# EAGLE design etch_a_sketch_schematic (EAGLE 9.6.2)
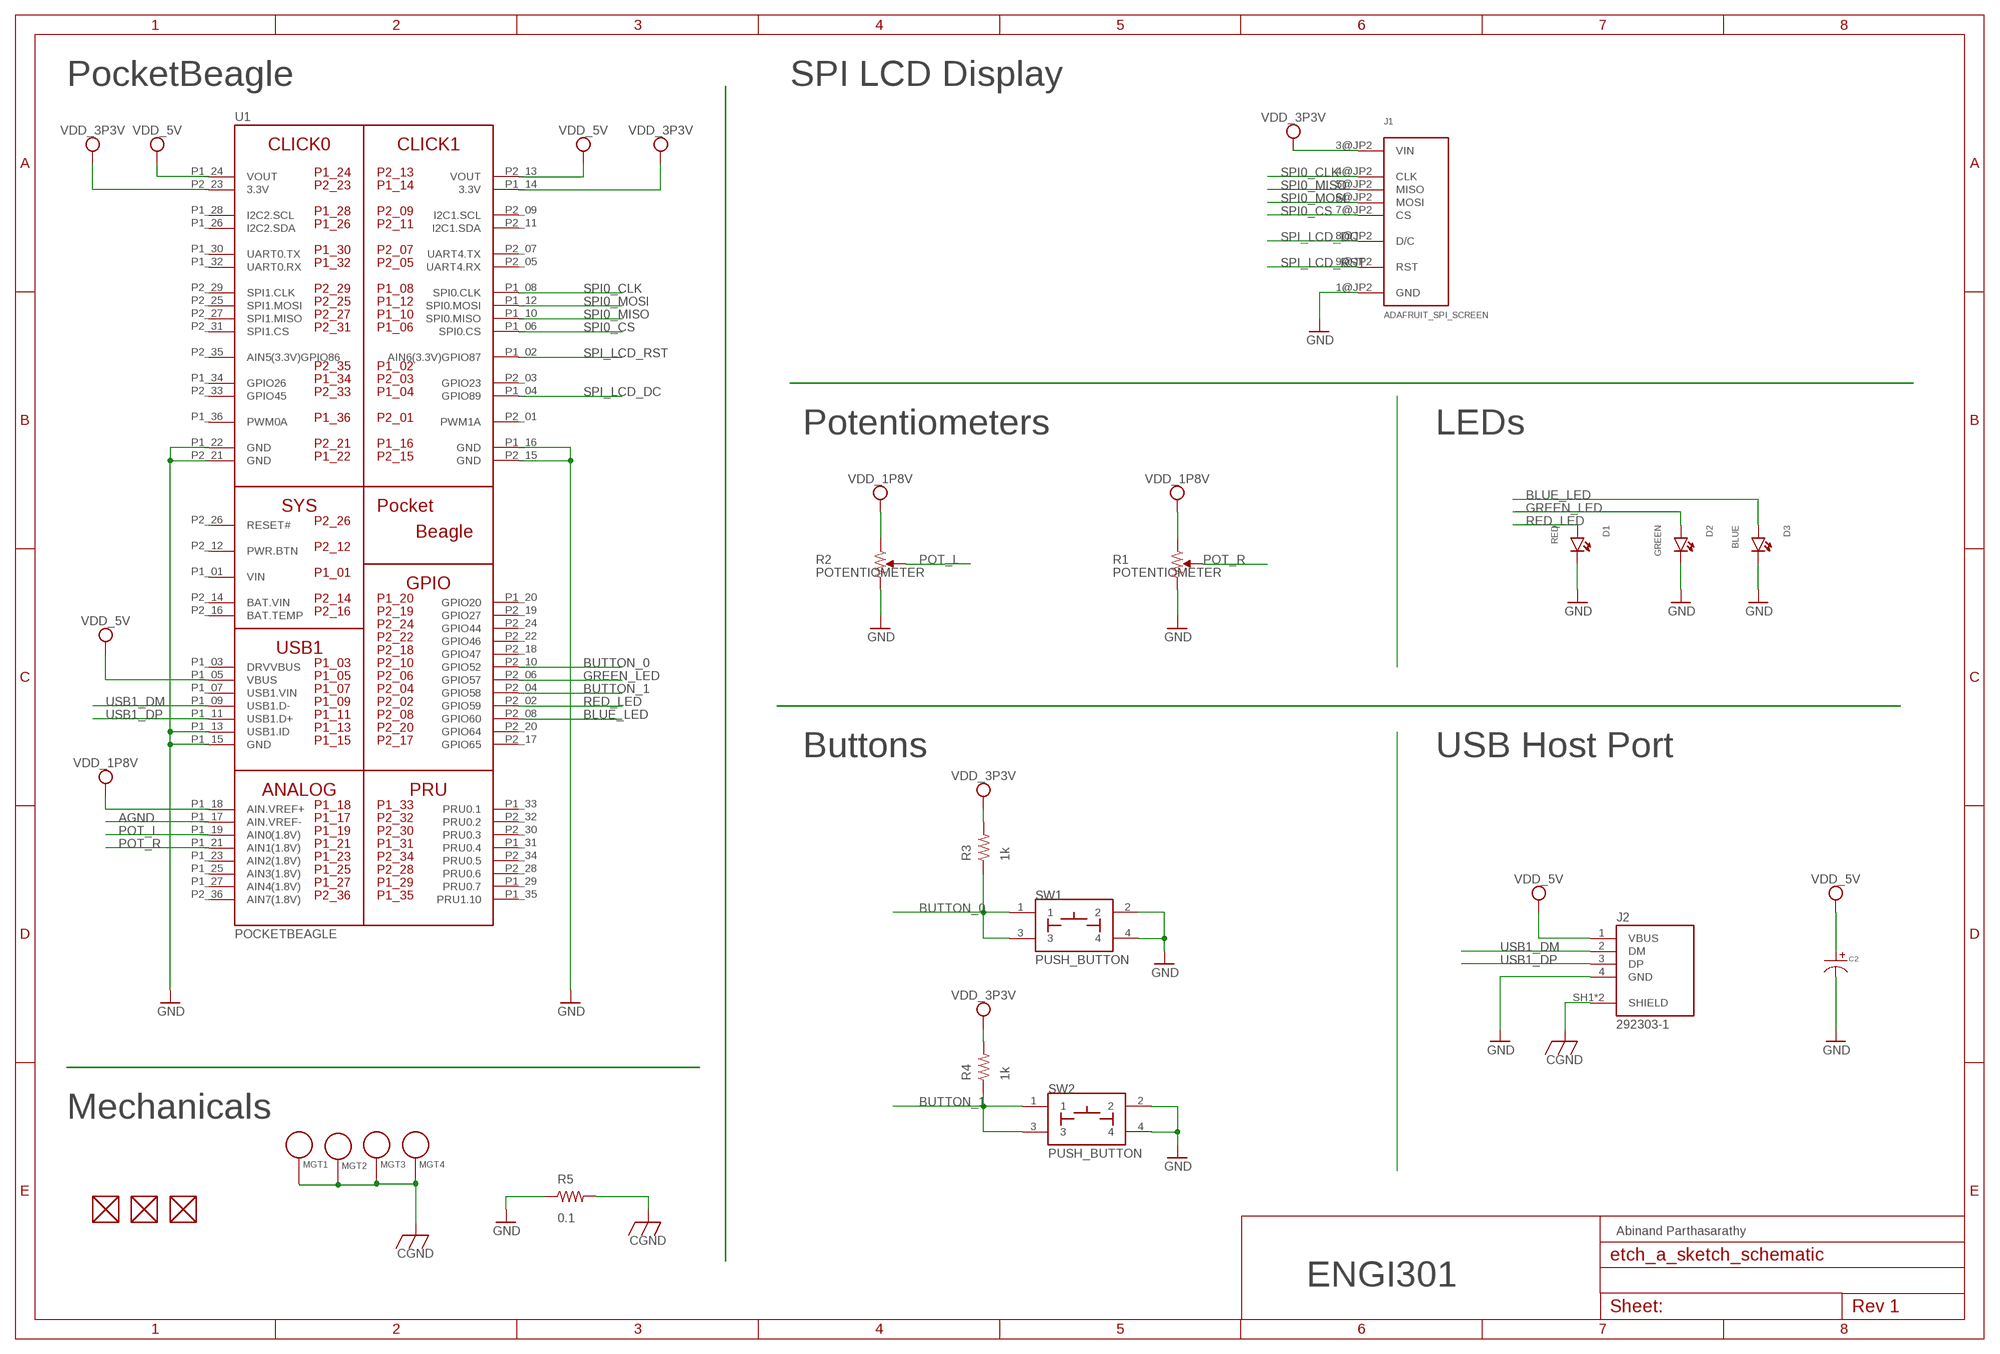
[diagram p0: schematic, sheet 1]

## Parts
C2  CAPACITOR_P_10MM  [CP10MM]
D1  RED  LED  [EIA-STD]
D2  GREEN  LED  [EIA-STD]
D3  BLUE  LED  [EIA-STD]
FUD2  FIDUCIAL  [FIDUCIAL_40MIL]
FUD4  FIDUCIAL  [FIDUCIAL_40MIL]
FUD6  FIDUCIAL  [FIDUCIAL_40MIL]
J1  ADAFRUIT_SPI_SCREEN  [ADAFRUIT_TFT_LCD_PCB]
J2  292303-1  [TE_292303-1]
MGT1  MOUNTING_HOLE  [MOUNTING_HOLE]
MGT2  MOUNTING_HOLE  [MOUNTING_HOLE]
MGT3  MOUNTING_HOLE  [MOUNTING_HOLE]
MGT4  MOUNTING_HOLE  [MOUNTING_HOLE]
R1  POTENTIOMETER  [POT-PO90S]
R2  POTENTIOMETER  [POT-PO90S]
R3  1k  R_R0603  [R0603]
R4  1k  R_R0603  [R0603]
R5  0.1  R_R0603  [R0603]
SW1  PUSH_BUTTON  [BUTTON_12.5MM]
SW2  PUSH_BUTTON  [BUTTON_12.5MM]
U1  POCKETBEAGLE  [POCKETBEAGLE]

## Nets
AGND: U1.P1_17(AIN.VREF-)
BLUE_LED: D3.ANODE U1.P2_08(GPIO60)
BUTTON_0: R3.1 SW1.1 SW1.3 U1.P2_10(GPIO52)
BUTTON_1: R4.1 SW2.1 SW2.3 U1.P2_04(GPIO58)
CGND: J2.SH1(SHIELD) J2.SH2(SHIELD) MGT1.P$1 MGT2.P$1 MGT3.P$1 MGT4.P$1 R5.2
GND: C2.P$2 D1.CATHODE D2.CATHODE D3.CATHODE J1.1@JP2(GND) J2.4(GND) R1.CW R2.CW R5.1 SW1.2 SW1.4 SW2.2 SW2.4 U1.P1_13(USB1.ID) U1.P1_15(GND) U1.P1_16(GND) U1.P1_22(GND) U1.P2_15(GND) U1.P2_21(GND)
GREEN_LED: D2.ANODE U1.P2_06(GPIO57)
POT_L: R2.S U1.P1_19(AIN0(1.8V))
POT_R: R1.S U1.P1_21(AIN1(1.8V))
RED_LED: D1.ANODE U1.P2_02(GPIO59)
SPI0_CLK: J1.4@JP2(CLK) U1.P1_08(SPI0.CLK)
SPI0_CS: J1.7@JP2(CS) U1.P1_06(SPI0.CS)
SPI0_MISO: J1.5@JP2(MISO) U1.P1_10(SPI0.MISO)
SPI0_MOSI: J1.6@JP2(MOSI) U1.P1_12(SPI0.MOSI)
SPI_LCD_DC: J1.8@JP2(D/C) U1.P1_04(GPIO89)
SPI_LCD_RST: J1.9@JP2(RST) U1.P1_02(AIN6(3.3V)GPIO87)
USB1_DM: J2.2(DM) U1.P1_09(USB1.D-)
USB1_DP: J2.3(DP) U1.P1_11(USB1.D+)
VDD_1P8V: R1.CCW R2.CCW U1.P1_18(AIN.VREF+)
VDD_3P3V: J1.3@JP2(VIN) R3.2 R4.2 U1.P1_14(3.3V) U1.P2_23(3.3V)
VDD_5V: C2.P$1 J2.1(VBUS) U1.P1_05(VBUS) U1.P1_24(VOUT) U1.P2_13(VOUT)
Unconnected: FUD2.P$1 FUD4.P$1 FUD6.P$1 U1.P1_03(DRVVBUS) U1.P1_07(USB1.VIN) U1.P1_20(GPIO20) U1.P1_23(AIN2(1.8V)) U1.P1_25(AIN3(1.8V)) U1.P1_26(I2C2.SDA) U1.P1_27(AIN4(1.8V)) U1.P1_28(I2C2.SCL) U1.P1_29(PRU0.7) U1.P1_30(UART0.TX) U1.P1_31(PRU0.4) U1.P1_32(UART0.RX) U1.P1_33(PRU0.1) U1.P1_34(GPIO26) U1.P1_35(PRU1.10) U1.P1_36(PWM0A) U1.P2_01(PWM1A) U1.P2_03(GPIO23) U1.P2_05(UART4.RX) U1.P2_07(UART4.TX) U1.P2_09(I2C1.SCL) U1.P2_11(I2C1.SDA) U1.P2_12(PWR.BTN) U1.P2_16(BAT.TEMP) U1.P2_17(GPIO65) U1.P2_18(GPIO47) U1.P2_19(GPIO27) U1.P2_20(GPIO64) U1.P2_22(GPIO46) U1.P2_24(GPIO44) U1.P2_25(SPI1.MOSI) U1.P2_26(RESET#) U1.P2_27(SPI1.MISO) U1.P2_28(PRU0.6) U1.P2_29(SPI1.CLK) U1.P2_30(PRU0.3) U1.P2_31(SPI1.CS) U1.P2_32(PRU0.2) U1.P2_33(GPIO45) U1.P2_34(PRU0.5) U1.P2_35(AIN5(3.3V)GPIO86) U1.P2_36(AIN7(1.8V))

## Notes on the sheet
- PocketBeagle | SPI LCD Display
- Potentiometers | LEDs
- Buttons | USB Host Port
- Mechanicals
- Abinand Parthasarathy
- ENGI301

## Power pins joined to a net without a drawn wire
BAT.VIN: U1.P2_14(BAT.VIN)
VIN: U1.P1_01(VIN)

## Library data of the parts
C2 = combo_lock2:CAPACITOR_P: Library: MF_Passives Description: Device for Polarized Capacitors. Manufacture part number (MPN), Voltage Rating, and Tolerance can be added via Attributes. Check https://factory.macrofab.com/parts for the house parts list.; POPULATE: 1
D1-D3 = combo_lock2:LED: EIA-STD LED, LTST-C191TBKT
FUD2 FUD4 FUD6 = combo_lock2:FIDUCIAL
J1 = combo_lock2:ADAFRUIT_SPI_SCREEN: Adafruit 2.8'' TFT SPI LCD Display: https://www.adafruit.com/product/1770 Created from: https://github.com/adafruit/2.8-TFT-Breakout-PCB
J2 = combo_lock2:292303-1: CONN USB RECEPT R/A TYPE A 4POS Check availability <https://pricing.snapeda.com/parts/292303-1/TE%20Connectivity/view-part?ref=eda>; AVAILABILITY: In Stock; CENTERLINE_PITCH: 2 mm[.078 in]; COMMENT: 292303-1; DESCRIPTION: Conn; Data; USB; Recept; 2.0; 4 Pos; 1 Port; Rt Angle; A Ser; Tin over Copper; EU_ROHS_COMPLIANCE: Compliant; MF: TE Connectivity; MP: 292303-1; NUMBER_OF_POSITIONS: 4; PACKAGE: None; PRICE: None; PRODUCT_TYPE: Connector; PURCHASE-URL: https://pricing.snapeda.com/search/part/292303-1/?ref=eda
MGT1-MGT4 = combo_lock2:MOUNTING_HOLE: Chassis Mounting Hole w/GND connection ability
R1 R2 = combo_lock2:POTENTIOMETER: Potentiometer - Examples: P090S-14T20BR10K (987-1277-ND)
R3-R5 = combo_lock2:R_: RESISTOR, American symbol
SW1 SW2 = combo_lock2:PUSH_BUTTON
U1 = combo_lock:POCKETBEAGLE

## Board
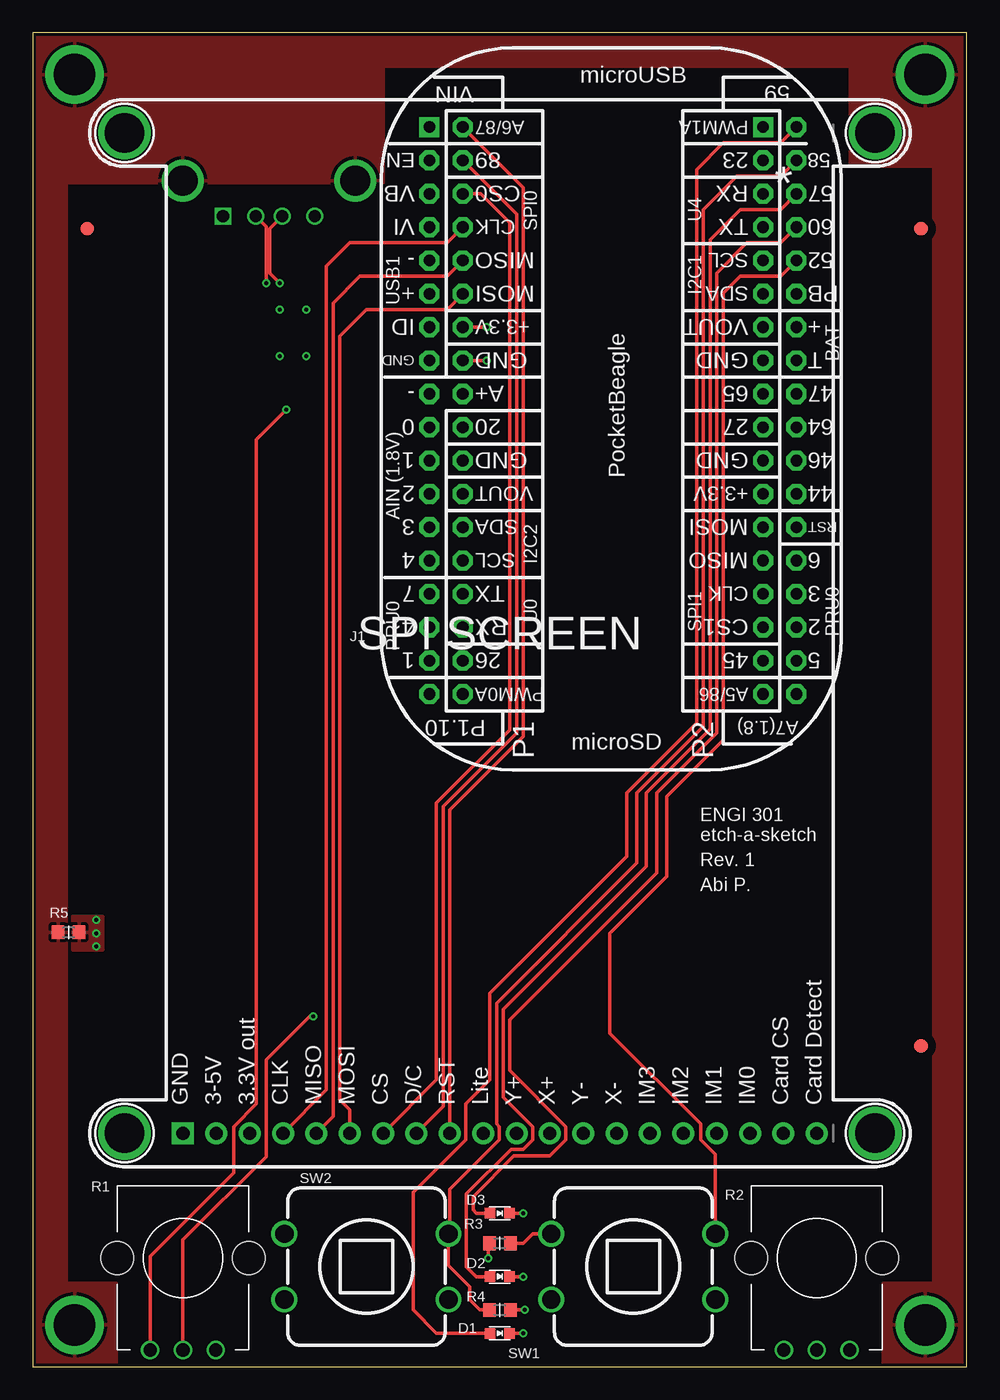
[diagram p1: board, top side]
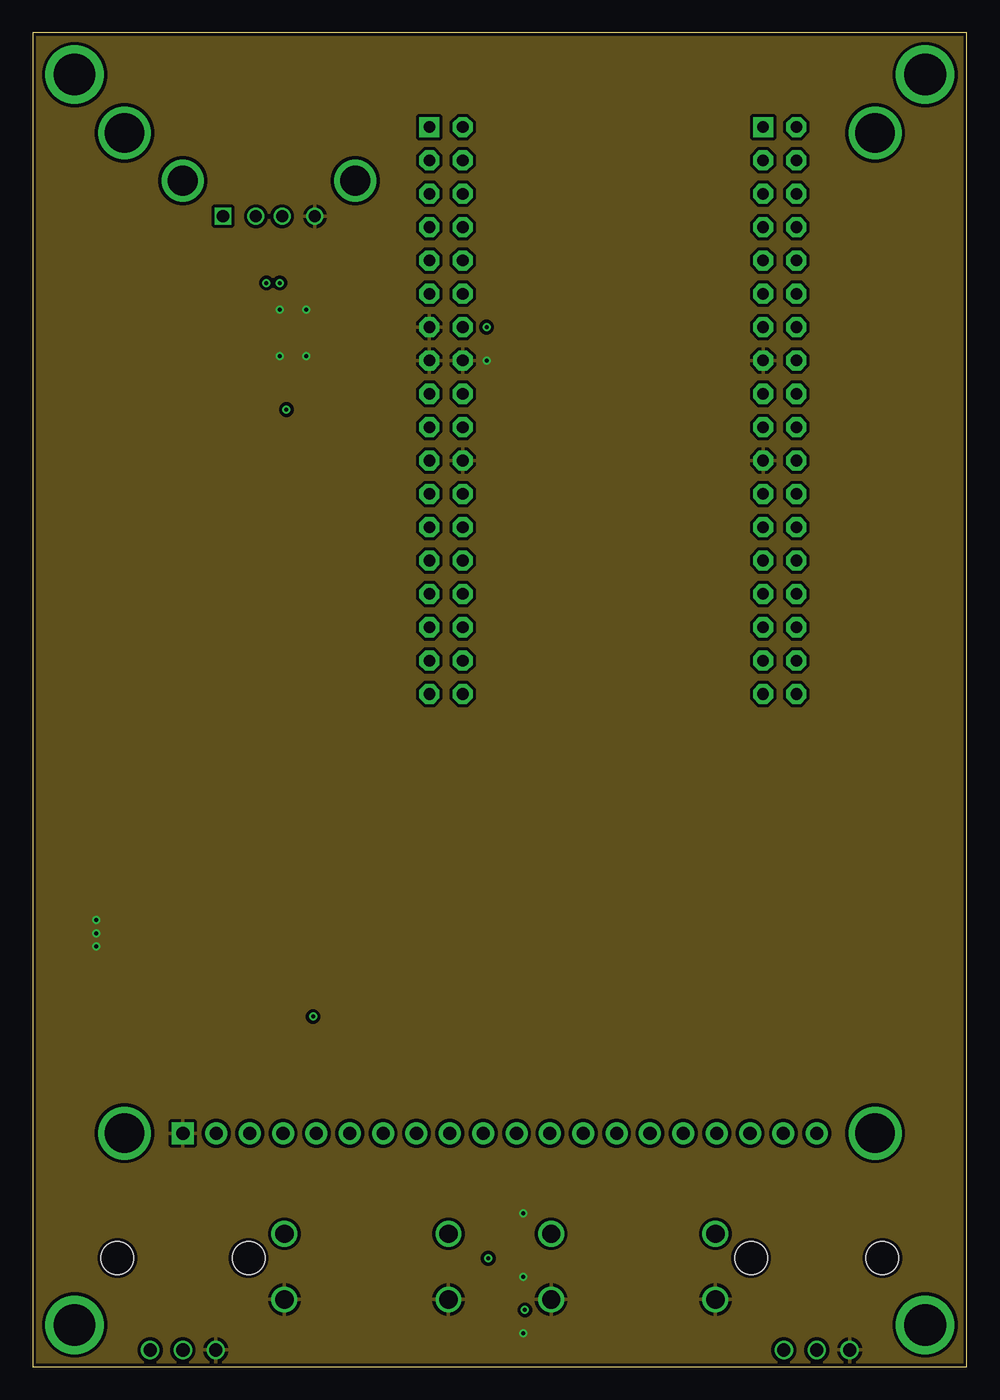
[diagram p2: board, inner layer Route2]
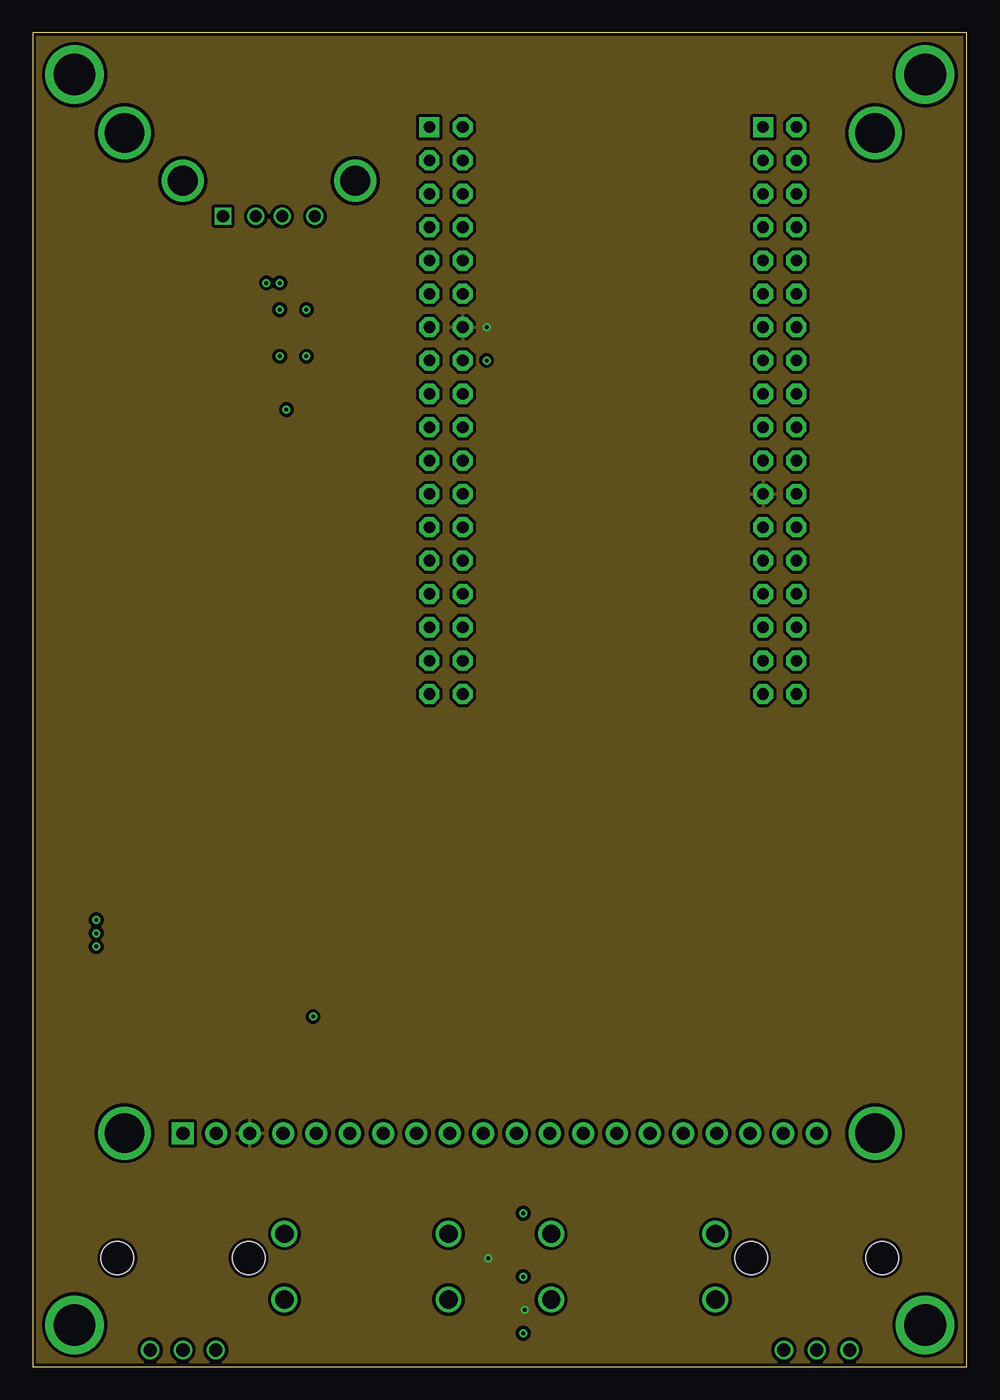
[diagram p3: board, inner layer Route15]
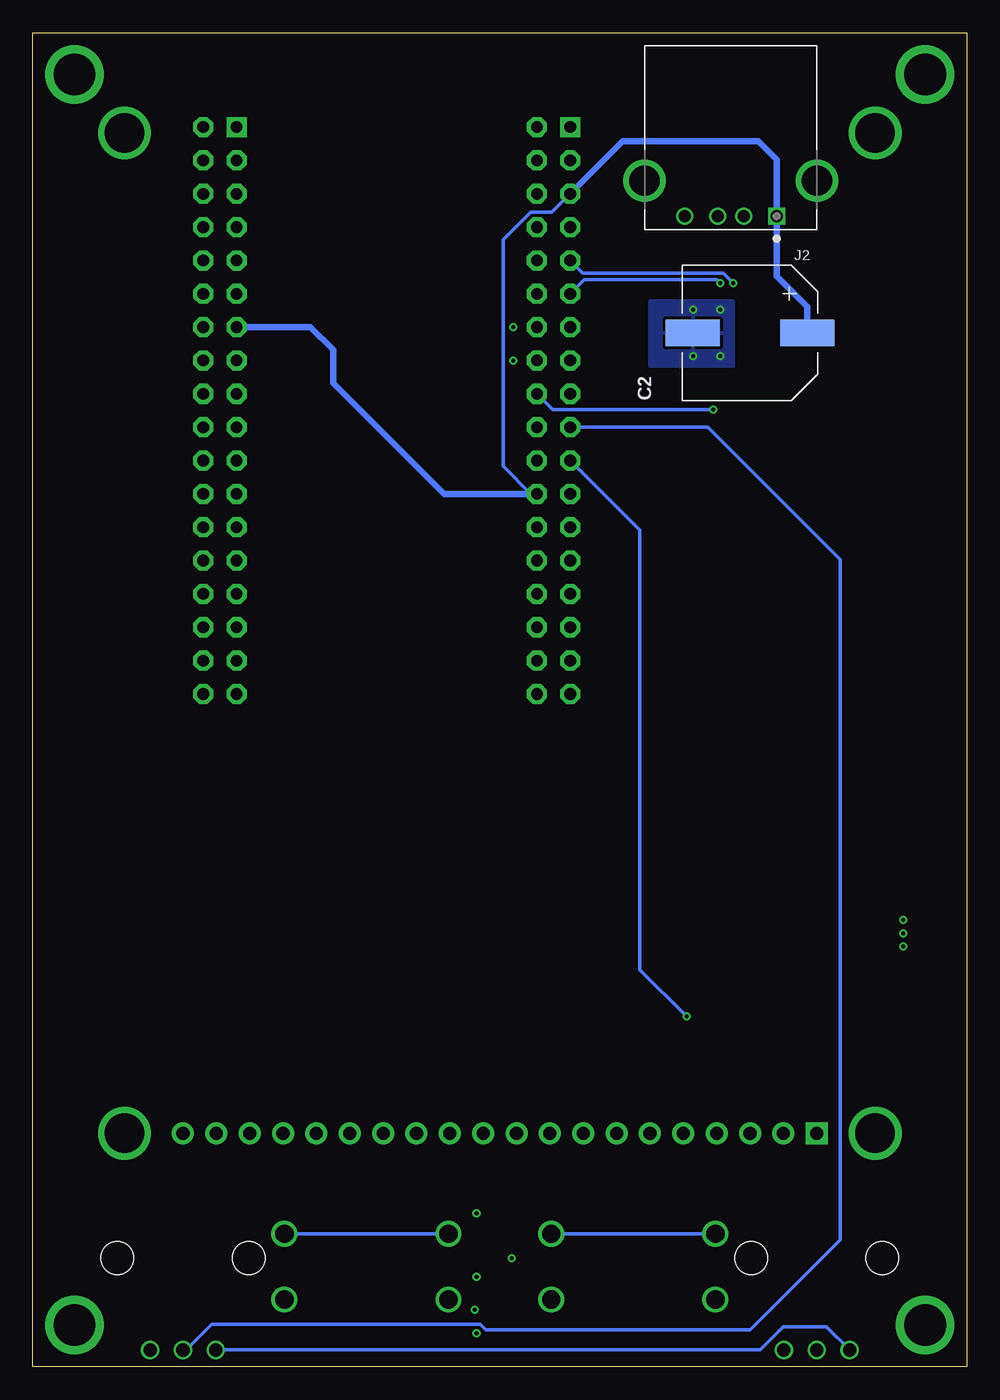
[diagram p4: board, bottom side, seen from below]

Size 71.12 x 101.6 mm. Coordinates in mm from the lower left corner, seen from the top.
Outline: 0,0 71.12,0 71.12,101.6 0,101.6 0,0
Copper layers (1*2*15*16): Top 0.035mm / dielectric 0.23mm / Route2 0.035mm / dielectric 0.93mm / Route15 0.035mm / dielectric 0.23mm / Bottom 0.035mm
Design rules "ENGI301_4lyr": minimum track width 10mil, minimum drill 12mil, track to track 10mil, track to pad 10mil, pad to pad 10mil, via to via 10mil, smd to smd 10mil, copper to edge 10mil, drill to drill 12mil, minimum pad ring 6mil, minimum via ring 6mil, stop-mask expansion 3mil, vias tented up to drill 25mil, thermal gap 10mil

### Footprints (pad centres in the part's own frame; a part is rotated, then mirrored left to right if it is on the bottom)
CP10MM = smd 2 x 4.1: P$1 0,-4.35; P$2 0,4.35
EIA-STD = smd 0.8 x 0.8: ANODE -0.75,0; CATHODE 0.75,0
FIDUCIAL_40MIL = smd 1.016 x 1.016: P$1 0,0
ADAFRUIT_TFT_LCD_PCB = drill 1 pad 1.676 square: 1@JP2 -24.13,-38.1 | drill 1 pad 1.676: 2@JP2 -21.59,-38.1; 3@JP2 -19.05,-38.1; 4@JP2 -16.51,-38.1; 5@JP2 -13.97,-38.1; 6@JP2 -11.43,-38.1; 7@JP2 -8.89,-38.1; 8@JP2 -6.35,-38.1; 9@JP2 -3.81,-38.1; 10@JP2 -1.27,-38.1; 11@JP2 1.27,-38.1; 12@JP2 3.81,-38.1; 13@JP2 6.35,-38.1; 14@JP2 8.89,-38.1; 15@JP2 11.43,-38.1; 16@JP2 13.97,-38.1; 17@JP2 16.51,-38.1; 18@JP2 19.05,-38.1; 19@JP2 21.59,-38.1; 20@JP2 24.13,-38.1 | drill 3 pad 3.6: P$1@U$7 -28.575,-38.1; P$1@U$15 28.575,-38.1; P$1@U$16 -28.575,38.1; P$1@U$17 28.575,38.1
TE_292303-1 = drill 0.92 square: 1 0,0 | drill 0.92: 2 2.5,0; 3 4.5,0; 4 7,0 | drill 2.3: SH1 -3.07,-2.71; SH2 10.07,-2.71
MOUNTING_HOLE = drill 3.175 pad 4.445: P$1 0,0
POT-PO90S = drill 1: CCW -2.5,0; CW 2.5,0; S 0,0 | hole 2.5: -5,7; 5,7
R0603 = smd 0.95 x 1.031: 1 -0.8,0; 2 0.8,0
BUTTON_12.5MM = drill 1.4: 1 -6.25,2.5; 2 -6.25,-2.5; 3 6.25,2.5; 4 6.25,-2.5
POCKETBEAGLE = drill 0.889 pad 1.524 square: P1_01 5.91,3.53; P2_01 5.91,28.93 | drill 0.889 pad 1.524 octagon: P1_02 5.91,6.07; P1_03 8.45,3.53; P1_04 8.45,6.07; P1_05 10.99,3.53; P1_06 10.99,6.07; P1_07 13.53,3.53; P1_08 13.53,6.07; P1_09 16.07,3.53; P1_10 16.07,6.07; P1_11 18.61,3.53; P1_12 18.61,6.07; P1_13 21.15,3.53; P1_14 21.15,6.07; P1_15 23.69,3.53; P1_16 23.69,6.07; P1_17 26.23,3.53; P1_18 26.23,6.07; P1_19 28.77,3.53; P1_20 28.77,6.07; P1_21 31.31,3.53; P1_22 31.31,6.07; P1_23 33.85,3.53; P1_24 33.85,6.07; P1_25 36.39,3.53; P1_26 36.39,6.07; P1_27 38.93,3.53; P1_28 38.93,6.07; P1_29 41.47,3.53; P1_30 41.47,6.07; P1_31 44.01,3.53; P1_32 44.01,6.07; P1_33 46.55,3.53; P1_34 46.55,6.07; P1_35 49.09,3.53; P1_36 49.09,6.07; P2_02 5.91,31.47; P2_03 8.45,28.93; P2_04 8.45,31.47; P2_05 10.99,28.93; P2_06 10.99,31.47; P2_07 13.53,28.93; P2_08 13.53,31.47; P2_09 16.07,28.93; P2_10 16.07,31.47; P2_11 18.61,28.93; P2_12 18.61,31.47; P2_13 21.15,28.93; P2_14 21.15,31.47; P2_15 23.69,28.93; P2_16 23.69,31.47; P2_17 26.23,28.93; P2_18 26.23,31.47; P2_19 28.77,28.93; P2_20 28.77,31.47; P2_21 31.31,28.93; P2_22 31.31,31.47; P2_23 33.85,28.93; P2_24 33.85,31.47; P2_25 36.39,28.93; P2_26 36.39,31.47; P2_27 38.93,28.93; P2_28 38.93,31.47; P2_29 41.47,28.93; P2_30 41.47,31.47; P2_31 44.01,28.93; P2_32 44.01,31.47; P2_33 46.55,28.93; P2_34 46.55,31.47; P2_35 49.09,28.93; P2_36 49.09,31.47

### Placement (x,y rotation side)
C2  16.51,78.74 90 bottom
D1  35.56,2.54 0 top
D2  35.56,6.86 0 top
D3  35.56,11.68 0 top
FUD2  67.63,24.45 0 top
FUD4  67.63,86.68 0 top
FUD6  4.13,86.68 0 top
J1  35.56,55.88 0 top
J2  14.48,87.63 180 bottom
MGT1  3.17,3.17 0 top
MGT2  67.94,98.42 0 top
MGT3  3.17,98.42 0 top
MGT4  67.94,3.17 0 top
R1  11.43,1.27 0 top
R2  59.69,1.27 0 top
R3  35.56,9.4 180 top
R4  35.56,4.32 0 top
R5  2.73,33.08 180 top
SW1  45.72,7.62 0 top
SW2  25.4,7.62 0 top
U1  26.67,100.33 270 top

### Tracks (layer width: path | path; a pad name or v marks a point on that pad's centre or on a via)
BLUE_LED
  Top 0.254: D3.ANODE 33.78,11.68 33.53,11.94 33.53,12.95 36.63,16.05 39.37,16.05 40.59,17.27 40.59,18.29 36.32,22.55 36.32,26.42 47.5,37.59 47.5,43.69 52.07,48.26 52.07,83.31 54.36,85.6 56.94,85.6 U1.P2_08
BUTTON_0
  Top 0.254: R3.1 37.34,9.4 38.06,10.12 SW1.1 | U1.P2_10 56.94,83.06 53.85,83.06 52.58,81.79 52.58,47.75 48.26,43.43 48.26,37.34 43.94,33.02 43.94,25.4 50.85,18.49 50.85,17.27 51.97,16.16 SW1.3
  Bottom 0.254: SW1.3 SW1.1
BUTTON_1
  Top 0.254: 34.67,4.32 34.04,4.32 33.27,5.08 33.27,6.1 31.65,7.72 SW2.3 31.75,10.22 31.75,13.52 35.51,17.27 35.51,18.29 35.31,18.49 35.31,27.69 45.97,38.35 45.97,43.69 51.05,48.77 51.05,88.14 53.59,90.68 56.94,90.68 U1.P2_04
  Top 0.508: R4.1 34.67,4.32
  Bottom 0.254: SW2.1 SW2.3
CGND
  pour Top: -2.54,104.14 -2.54,-2.54 6.35,-2.54 6.35,6.35 2.54,6.35 2.54,90.17 26.67,90.17 26.67,99.06 62.23,99.06 62.23,91.44 68.58,91.44 68.58,6.35 64.77,6.35 64.77,-2.54 73.66,-2.54 73.66,104.14
GND  (via drill 0.3 pad 0.61)
  Top 0.254: D3.CATHODE v37.34,11.68 | D2.CATHODE v37.34,6.86 | D1.CATHODE v37.34,2.54 | U1.P1_16 v34.54,76.64
  Bottom 0.508: 21.37,87.52 J2.4
  other vias: 4.83,34.04 4.83,33.02 4.83,32 18.8,76.96 20.83,80.52 18.8,80.52 20.83,76.96
  pour Route2: -5.08,106.68 76.2,106.68 76.2,-5.08 -5.08,-5.08
  pour Top: 3.05,34.29 5.33,34.29 5.33,31.75 3.05,31.75
  pour Bottom: 17.78,76.2 17.78,81.15 24.13,81.15 24.13,76.2
GREEN_LED
  Top 0.254: D2.ANODE 33.78,6.86 33.02,7.62 33.02,13.16 36.42,16.56 37.34,16.56 38.05,17.27 38.05,18.29 35.81,20.52 35.81,27.22 46.71,38.12 46.71,43.71 51.56,48.56 51.56,85.85 53.85,88.14 56.94,88.14 U1.P2_06
POT_L
  Bottom 0.254: R2.S 59.44,1.27 57.48,3.23 37.05,3.23 36.62,2.79 16.51,2.79 9.65,9.65 9.65,61.47 19.74,71.56 U1.P1_19
POT_R  (via drill 0.3 pad 0.61)
  Top 0.254: R1.S 11.43,9.65 17.78,16 17.78,23.37 21.08,26.67 v21.34,26.67
  Bottom 0.254: v21.34,26.67 24.89,30.23 24.89,63.71 U1.P1_21
RED_LED
  Top 0.254: D1.ANODE 30.73,2.54 28.96,4.32 28.96,13.26 32.97,17.27 32.97,20.02 34.8,21.84 34.8,28.45 45.21,38.86 45.21,43.69 50.55,49.02 50.55,91.19 52.58,93.22 56.94,93.22 U1.P2_02
SPI0_CLK
  Top 0.254: J1.4@JP2 22.35,21.08 22.35,83.82 24.13,85.6 31.54,85.6 U1.P1_08
SPI0_CS
  Top 0.254: U1.P1_06 34.1,89.34 36.32,87.12 36.32,48.51 30.73,42.93 30.73,21.84 J1.7@JP2
SPI0_MISO
  Top 0.254: J1.5@JP2 22.86,19.05 22.86,81.03 24.89,83.06 31.54,83.06 U1.P1_10
SPI0_MOSI
  Top 0.254: J1.6@JP2 24.13,19.56 23.37,20.32 23.37,78.49 25.4,80.52 31.54,80.52 U1.P1_12
SPI_LCD_DC
  Top 0.254: U1.P1_04 36.83,87.79 36.83,48.26 31.24,42.67 31.24,19.81 J1.8@JP2
SPI_LCD_RST
  Top 0.254: U1.P1_02 37.34,89.82 37.34,48.01 31.75,42.42 J1.9@JP2
USB1_DM  (via drill 0.3 pad 0.61)
  Top 0.254: J2.2 17.78,86.83 v17.78,82.55
  Bottom 0.254: U1.P1_09 29.25,83.31 18.54,83.31 v17.78,82.55
USB1_DP  (via drill 0.3 pad 0.61)
  Top 0.254: J2.3 18.03,86.69 18.03,83.31 v18.8,82.55
  Bottom 0.254: U1.P1_11 29.12,82.8 19.05,82.8 v18.8,82.55
VDD_1P8V  (via drill 0.3 pad 0.61)
  Top 0.254: R1.CCW 8.93,8.42 15.29,14.78 15.29,18.29 17.02,20.01 17.02,70.61 v19.3,72.9
  Bottom 0.254: R2.CCW 15.75,1.27 13.97,3.05 10.71,3.05 R1.CCW | U1.P1_18 31.54,72.9 v19.3,72.9
VDD_3P3V  (via drill 0.3 pad 0.61)
  Top 0.254: R3.2 34.67,9.31 v34.67,8.26 | R4.2 v37.47,4.32 | U1.P1_14 v34.54,79.18
  pour Route15: -7.62,-7.62 -7.62,109.22 78.74,109.22 78.74,-7.62
VDD_5V
  Bottom 0.254: U1.P1_05 31.6,87.94 33.21,87.94 35.31,85.85 35.31,68.58 33.21,66.48 33.02,66.48
  Bottom 0.508: U1.P1_24 33.02,66.48 39.81,66.48 48.26,74.93 48.26,77.47 49.99,79.2 55.58,79.2 U1.P2_13 | C2.P$1 12.16,80.74 14.48,83.06 J2.1 14.48,91.95 15.88,93.34 26.2,93.34 U1.P1_05

### Text on the board
tPlace: ENGI 301 / etch-a-sketch | Rev. 1 | Abi P.